# Altium schematic sheet ASBB.SchDoc
size A4
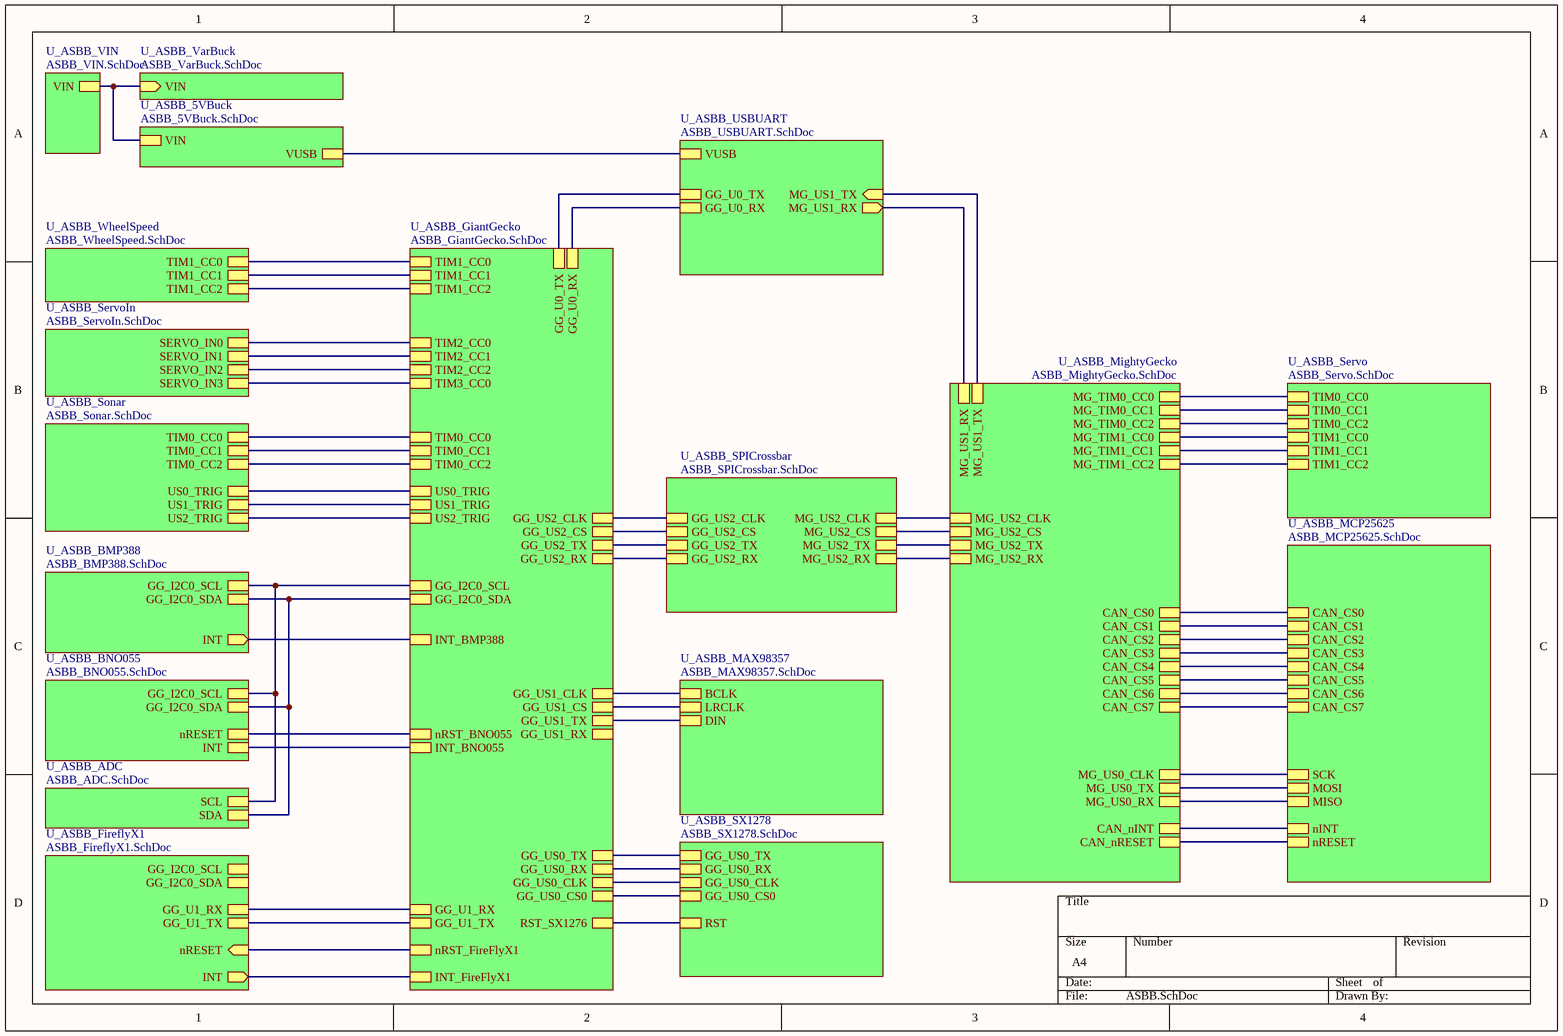
[diagram p0: ASBB.SchDoc]

## Sub-sheets
U_ASBB_5VBuck = ASBB_5VBuck.SchDoc: VIN, VUSB
U_ASBB_ADC = ASBB_ADC.SchDoc: SDA, SCL
U_ASBB_BMP388 = ASBB_BMP388.SchDoc: INT (out), GG_I2C0_SCL, GG_I2C0_SDA
U_ASBB_BNO055 = ASBB_BNO055.SchDoc: INT, GG_I2C0_SCL, GG_I2C0_SDA, nRESET
U_ASBB_FireflyX1 = ASBB_FireflyX1.SchDoc: INT (out), nRESET (in), GG_U1_TX, GG_I2C0_SCL, GG_U1_RX, GG_I2C0_SDA
U_ASBB_GiantGecko = ASBB_GiantGecko.SchDoc: GG_U0_TX, GG_US1_CLK, GG_US0_CS0, GG_US2_RX, GG_U1_RX, GG_US2_CLK, GG_US1_TX, GG_US0_TX, GG_US2_TX, GG_US1_RX, GG_I2C0_SDA, GG_U1_TX, GG_US2_CS, GG_U0_RX, GG_US0_RX, GG_US1_CS, GG_US0_CLK, GG_I2C0_SCL, INT_BNO055, INT_BMP388, nRST_FireFlyX1, INT_FireFlyX1, RST_SX1276, TIM1_CC1, TIM0_CC0, TIM1_CC0, TIM0_CC2, TIM1_CC2, TIM0_CC1, US2_TRIG, US1_TRIG, US0_TRIG, nRST_BNO055, TIM2_CC0, TIM3_CC0, TIM2_CC2, TIM2_CC1
U_ASBB_MAX98357 = ASBB_MAX98357.SchDoc: BCLK, LRCLK, DIN
U_ASBB_MCP25625 = ASBB_MCP25625.SchDoc: SCK, MOSI, MISO, CAN_CS7, CAN_CS1, CAN_CS4, CAN_CS5, CAN_CS0, CAN_CS3, CAN_CS6, CAN_CS2, nINT, nRESET
U_ASBB_MightyGecko = ASBB_MightyGecko.SchDoc: MG_US0_CLK, MG_US0_RX, MG_US0_TX, MG_US2_CLK, MG_US2_RX, MG_US2_TX, MG_US2_CS, MG_US1_RX, MG_US1_TX, MG_TIM0_CC0, MG_TIM1_CC0, MG_TIM0_CC1, MG_TIM0_CC2, CAN_nRESET, MG_TIM1_CC1, MG_TIM1_CC2, CAN_CS1, CAN_CS0, CAN_CS6, CAN_CS2, CAN_CS4, CAN_CS7, CAN_CS5, CAN_CS3, CAN_nINT
U_ASBB_Servo = ASBB_Servo.SchDoc: TIM0_CC0, TIM0_CC1, TIM0_CC2, TIM1_CC0, TIM1_CC1, TIM1_CC2
U_ASBB_ServoIn = ASBB_ServoIn.SchDoc: SERVO_IN0, SERVO_IN2, SERVO_IN1, SERVO_IN3
U_ASBB_Sonar = ASBB_Sonar.SchDoc: TIM0_CC0, US0_TRIG, TIM0_CC1, US1_TRIG, TIM0_CC2, US2_TRIG
U_ASBB_SPICrossbar = ASBB_SPICrossbar.SchDoc: GG_US2_CLK, GG_US2_TX, GG_US2_CS, MG_US2_CLK, MG_US2_TX, MG_US2_RX, MG_US2_CS, GG_US2_RX
U_ASBB_SX1278 = ASBB_SX1278.SchDoc: RST, GG_US0_TX, GG_US0_RX, GG_US0_CLK, GG_US0_CS0
U_ASBB_USBUART = ASBB_USBUART.SchDoc: GG_U0_TX, GG_U0_RX, MG_US1_TX (in), MG_US1_RX (out), VUSB
U_ASBB_VarBuck = ASBB_VarBuck.SchDoc: VIN (in)
U_ASBB_VIN = ASBB_VIN.SchDoc: VIN
U_ASBB_WheelSpeed = ASBB_WheelSpeed.SchDoc: TIM1_CC0, TIM1_CC1, TIM1_CC2

## Nets
(unnamed): sheet U_ASBB_VarBuck/VIN, sheet U_ASBB_5VBuck/VIN, sheet U_ASBB_VIN/VIN
(unnamed): sheet U_ASBB_5VBuck/VUSB, sheet U_ASBB_USBUART/VUSB
(unnamed): sheet U_ASBB_USBUART/GG_U0_TX, sheet U_ASBB_GiantGecko/GG_U0_TX
(unnamed): sheet U_ASBB_USBUART/GG_U0_RX, sheet U_ASBB_GiantGecko/GG_U0_RX
(unnamed): sheet U_ASBB_USBUART/MG_US1_TX, sheet U_ASBB_MightyGecko/MG_US1_TX
(unnamed): sheet U_ASBB_USBUART/MG_US1_RX, sheet U_ASBB_MightyGecko/MG_US1_RX
(unnamed): sheet U_ASBB_BMP388/INT, sheet U_ASBB_GiantGecko/INT_BMP388
(unnamed): sheet U_ASBB_BMP388/GG_I2C0_SCL, sheet U_ASBB_BNO055/GG_I2C0_SCL, sheet U_ASBB_GiantGecko/GG_I2C0_SCL, sheet U_ASBB_ADC/SCL
(unnamed): sheet U_ASBB_BMP388/GG_I2C0_SDA, sheet U_ASBB_BNO055/GG_I2C0_SDA, sheet U_ASBB_GiantGecko/GG_I2C0_SDA, sheet U_ASBB_ADC/SDA
(unnamed): sheet U_ASBB_BNO055/INT, sheet U_ASBB_GiantGecko/INT_BNO055
(unnamed): sheet U_ASBB_BNO055/nRESET, sheet U_ASBB_GiantGecko/nRST_BNO055
(unnamed): sheet U_ASBB_MAX98357/BCLK, sheet U_ASBB_GiantGecko/GG_US1_CLK
(unnamed): sheet U_ASBB_MAX98357/LRCLK, sheet U_ASBB_GiantGecko/GG_US1_CS
(unnamed): sheet U_ASBB_MAX98357/DIN, sheet U_ASBB_GiantGecko/GG_US1_TX
(unnamed): sheet U_ASBB_MCP25625/SCK, sheet U_ASBB_MightyGecko/MG_US0_CLK
(unnamed): sheet U_ASBB_MCP25625/MOSI, sheet U_ASBB_MightyGecko/MG_US0_TX
(unnamed): sheet U_ASBB_MCP25625/MISO, sheet U_ASBB_MightyGecko/MG_US0_RX
(unnamed): sheet U_ASBB_MCP25625/CAN_CS7, sheet U_ASBB_MightyGecko/CAN_CS7
(unnamed): sheet U_ASBB_MCP25625/CAN_CS1, sheet U_ASBB_MightyGecko/CAN_CS1
(unnamed): sheet U_ASBB_MCP25625/CAN_CS4, sheet U_ASBB_MightyGecko/CAN_CS4
(unnamed): sheet U_ASBB_MCP25625/CAN_CS5, sheet U_ASBB_MightyGecko/CAN_CS5
(unnamed): sheet U_ASBB_MCP25625/CAN_CS0, sheet U_ASBB_MightyGecko/CAN_CS0
(unnamed): sheet U_ASBB_MCP25625/CAN_CS3, sheet U_ASBB_MightyGecko/CAN_CS3
(unnamed): sheet U_ASBB_MCP25625/CAN_CS6, sheet U_ASBB_MightyGecko/CAN_CS6
(unnamed): sheet U_ASBB_MCP25625/CAN_CS2, sheet U_ASBB_MightyGecko/CAN_CS2
(unnamed): sheet U_ASBB_MCP25625/nINT, sheet U_ASBB_MightyGecko/CAN_nINT
(unnamed): sheet U_ASBB_MCP25625/nRESET, sheet U_ASBB_MightyGecko/CAN_nRESET
(unnamed): sheet U_ASBB_FireflyX1/INT, sheet U_ASBB_GiantGecko/INT_FireFlyX1
(unnamed): sheet U_ASBB_FireflyX1/nRESET, sheet U_ASBB_GiantGecko/nRST_FireFlyX1
(unnamed): sheet U_ASBB_FireflyX1/GG_U1_TX, sheet U_ASBB_GiantGecko/GG_U1_TX
(unnamed): sheet U_ASBB_FireflyX1/GG_U1_RX, sheet U_ASBB_GiantGecko/GG_U1_RX
(unnamed): sheet U_ASBB_SX1278/RST, sheet U_ASBB_GiantGecko/RST_SX1276
(unnamed): sheet U_ASBB_SX1278/GG_US0_TX, sheet U_ASBB_GiantGecko/GG_US0_TX
(unnamed): sheet U_ASBB_SX1278/GG_US0_RX, sheet U_ASBB_GiantGecko/GG_US0_RX
(unnamed): sheet U_ASBB_SX1278/GG_US0_CLK, sheet U_ASBB_GiantGecko/GG_US0_CLK
(unnamed): sheet U_ASBB_SX1278/GG_US0_CS0, sheet U_ASBB_GiantGecko/GG_US0_CS0
(unnamed): sheet U_ASBB_GiantGecko/GG_US2_RX, sheet U_ASBB_SPICrossbar/GG_US2_RX
(unnamed): sheet U_ASBB_GiantGecko/GG_US2_CLK, sheet U_ASBB_SPICrossbar/GG_US2_CLK
(unnamed): sheet U_ASBB_GiantGecko/GG_US2_TX, sheet U_ASBB_SPICrossbar/GG_US2_TX
(unnamed): sheet U_ASBB_GiantGecko/GG_US2_CS, sheet U_ASBB_SPICrossbar/GG_US2_CS
(unnamed): sheet U_ASBB_GiantGecko/TIM1_CC1, sheet U_ASBB_WheelSpeed/TIM1_CC1
(unnamed): sheet U_ASBB_GiantGecko/TIM0_CC0, sheet U_ASBB_Sonar/TIM0_CC0
(unnamed): sheet U_ASBB_GiantGecko/TIM1_CC0, sheet U_ASBB_WheelSpeed/TIM1_CC0
(unnamed): sheet U_ASBB_GiantGecko/TIM0_CC2, sheet U_ASBB_Sonar/TIM0_CC2
(unnamed): sheet U_ASBB_GiantGecko/TIM1_CC2, sheet U_ASBB_WheelSpeed/TIM1_CC2
(unnamed): sheet U_ASBB_GiantGecko/TIM0_CC1, sheet U_ASBB_Sonar/TIM0_CC1
(unnamed): sheet U_ASBB_GiantGecko/US2_TRIG, sheet U_ASBB_Sonar/US2_TRIG
(unnamed): sheet U_ASBB_GiantGecko/US1_TRIG, sheet U_ASBB_Sonar/US1_TRIG
(unnamed): sheet U_ASBB_GiantGecko/US0_TRIG, sheet U_ASBB_Sonar/US0_TRIG
(unnamed): sheet U_ASBB_GiantGecko/TIM2_CC0, sheet U_ASBB_ServoIn/SERVO_IN0
(unnamed): sheet U_ASBB_GiantGecko/TIM3_CC0, sheet U_ASBB_ServoIn/SERVO_IN3
(unnamed): sheet U_ASBB_GiantGecko/TIM2_CC2, sheet U_ASBB_ServoIn/SERVO_IN2
(unnamed): sheet U_ASBB_GiantGecko/TIM2_CC1, sheet U_ASBB_ServoIn/SERVO_IN1
(unnamed): sheet U_ASBB_Servo/TIM0_CC0, sheet U_ASBB_MightyGecko/MG_TIM0_CC0
(unnamed): sheet U_ASBB_Servo/TIM0_CC1, sheet U_ASBB_MightyGecko/MG_TIM0_CC1
(unnamed): sheet U_ASBB_Servo/TIM0_CC2, sheet U_ASBB_MightyGecko/MG_TIM0_CC2
(unnamed): sheet U_ASBB_Servo/TIM1_CC0, sheet U_ASBB_MightyGecko/MG_TIM1_CC0
(unnamed): sheet U_ASBB_Servo/TIM1_CC1, sheet U_ASBB_MightyGecko/MG_TIM1_CC1
(unnamed): sheet U_ASBB_Servo/TIM1_CC2, sheet U_ASBB_MightyGecko/MG_TIM1_CC2
(unnamed): sheet U_ASBB_MightyGecko/MG_US2_CLK, sheet U_ASBB_SPICrossbar/MG_US2_CLK
(unnamed): sheet U_ASBB_MightyGecko/MG_US2_RX, sheet U_ASBB_SPICrossbar/MG_US2_RX
(unnamed): sheet U_ASBB_MightyGecko/MG_US2_TX, sheet U_ASBB_SPICrossbar/MG_US2_TX
(unnamed): sheet U_ASBB_MightyGecko/MG_US2_CS, sheet U_ASBB_SPICrossbar/MG_US2_CS